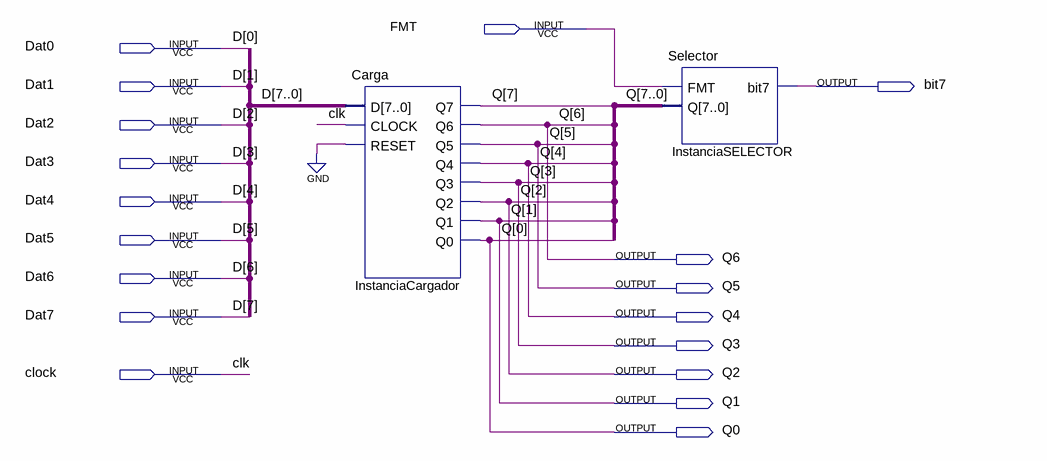
[diagram p0: schematic sheet]
// Quartus schematic UART4.bdf as structural Verilog: 2 symbols, 18 pins
module UART4 (
  input  FMT,
  input  Dat0,
  input  Dat1,
  input  Dat2,
  input  Dat3,
  input  Dat4,
  input  Dat5,
  input  Dat6,
  input  Dat7,
  input  clock,
  output bit7,
  output Q6,
  output Q5,
  output Q4,
  output Q3,
  output Q2,
  output Q1,
  output Q0
);

  wire [7:7] Q;

  Carga InstanciaCargador (
    .D({Dat7, Dat6, Dat5, Dat4, Dat3, Dat2, Dat1, Dat0}), .CLOCK(clock), .RESET(1'b0), .Q7(Q[7]), .Q6(Q6),
    .Q5(Q5), .Q4(Q4), .Q3(Q3), .Q2(Q2), .Q1(Q1), .Q0(Q0));
  Selector InstanciaSELECTOR (.FMT(FMT), .Q({Q[7], Q6, Q5, Q4, Q3, Q2, Q1, Q0}), .bit7(bit7));

  // Other names for the same wires on the sheet: clk = clock;
  //   D[7:0] = {Dat7, Dat6, Dat5, Dat4, Dat3, Dat2, Dat1, Dat0}
endmodule
